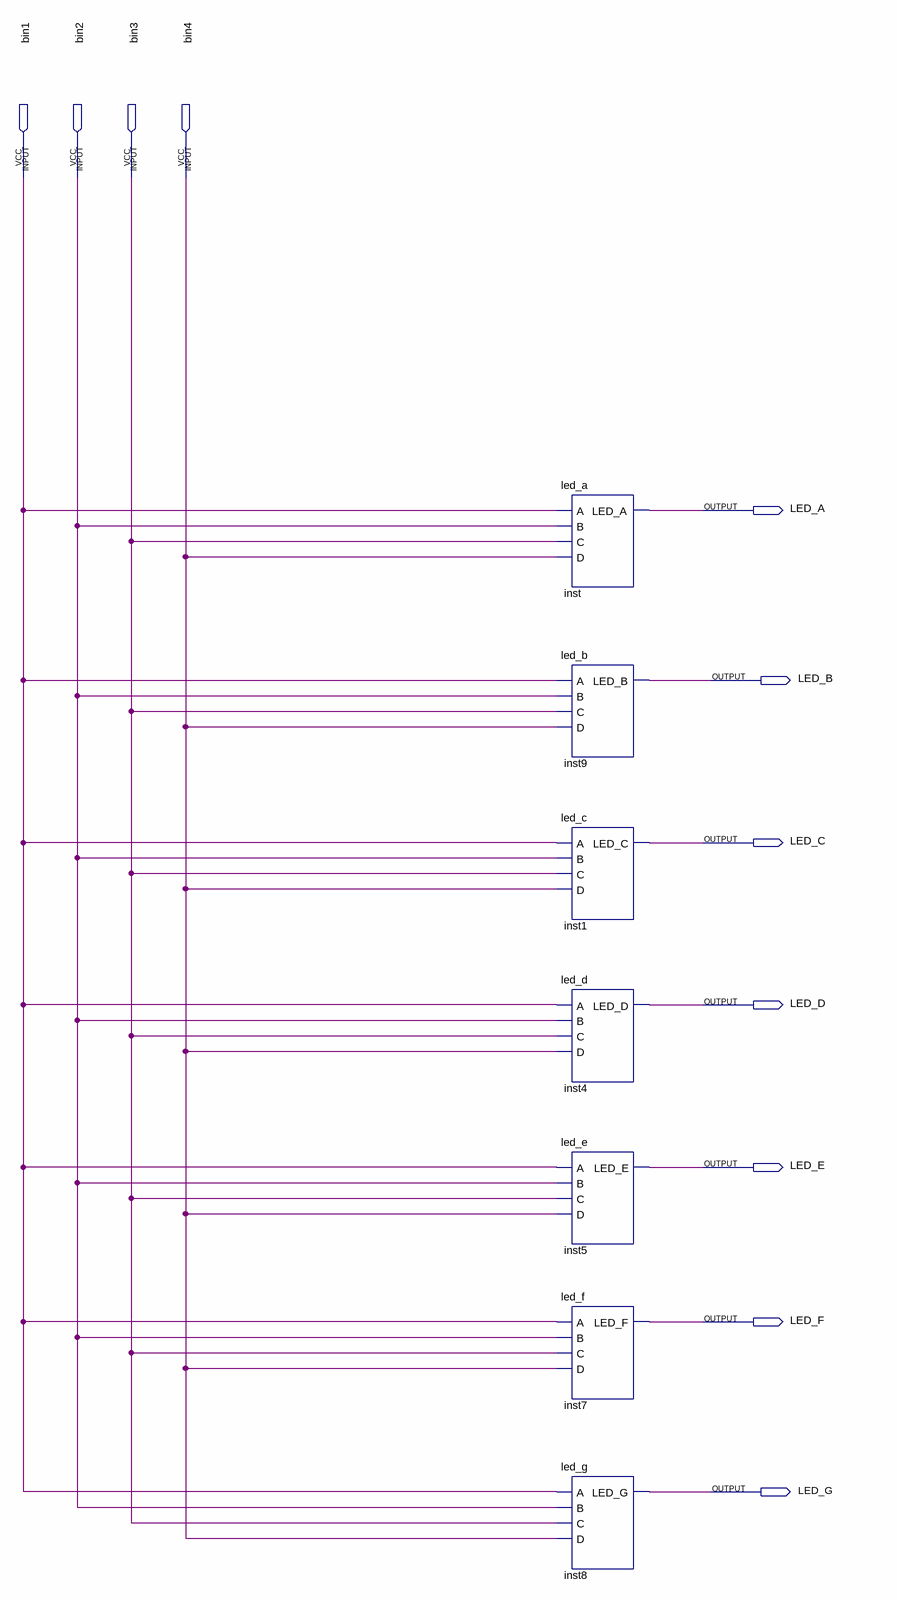
[diagram p0: schematic sheet]
// Quartus schematic 7_seg_A.bdf as structural Verilog: 7 symbols, 11 pins
module \7_seg_A  (
  input  bin1,
  input  bin2,
  input  bin3,
  input  bin4,
  output LED_A,
  output LED_B,
  output LED_C,
  output LED_D,
  output LED_E,
  output LED_F,
  output LED_G
);

  led_a inst (.A(bin1), .B(bin2), .C(bin3), .D(bin4), .LED_A(LED_A));
  led_b inst9 (.A(bin1), .B(bin2), .C(bin3), .D(bin4), .LED_B(LED_B));
  led_c inst1 (.A(bin1), .B(bin2), .C(bin3), .D(bin4), .LED_C(LED_C));
  led_d inst4 (.A(bin1), .B(bin2), .C(bin3), .D(bin4), .LED_D(LED_D));
  led_e inst5 (.A(bin1), .B(bin2), .C(bin3), .D(bin4), .LED_E(LED_E));
  led_f inst7 (.A(bin1), .B(bin2), .C(bin3), .D(bin4), .LED_F(LED_F));
  led_g inst8 (.A(bin1), .B(bin2), .C(bin3), .D(bin4), .LED_G(LED_G));
endmodule
